# EAGLE schematic 5vTemp (EAGLE 6.5.0)
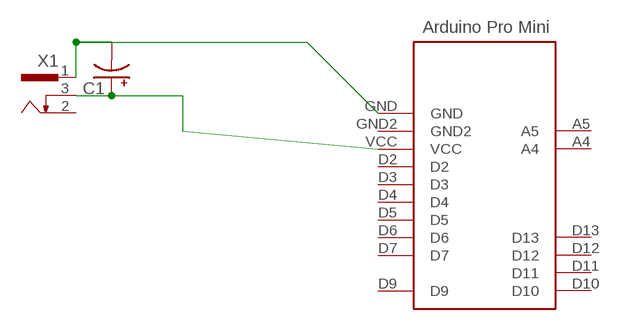
[diagram p0: schematic, sheet 1]

## Parts
C1  CPOL-USSANYO_C  [SANYO-OSCON_C]
U$1  ARDUINO_PRO_MINI_5V_V2V2  [ARDUINO_PRO_MINI_5V_V2]
X1  733980-62  [733980-62]

## Nets
N$1: C1.+ U$1.VCC X1.3
N$2: C1.- U$1.GND X1.1
Unconnected: U$1.A4 U$1.A5 U$1.D2 U$1.D3 U$1.D4 U$1.D5 U$1.D6 U$1.D7 U$1.D9 U$1.D10 U$1.D11 U$1.D12 U$1.D13 U$1.GND2 X1.2

## Library data of the parts
C1 = rcl:CPOL-US: POLARIZED CAPACITOR, American symbol
U$1 = ArduinoProMini5V:ARDUINO_PRO_MINI_5V_V2: Arduino Pro Mini 5V/16MHz Version 2: FTDI Pins left on Arduino. No TX0 and TXI pins. Battery monitor and alarm removed.(A3 and D8) Camera pins not used. (A2, A1 and A0)
X1 = con-conrad:73398?: FEMALE PRINT CONNECTOR Niedervolt-Steckverbinder Distributor Conrad